# EasyEDA Pro project full_pcb_files.epro, board PCB2
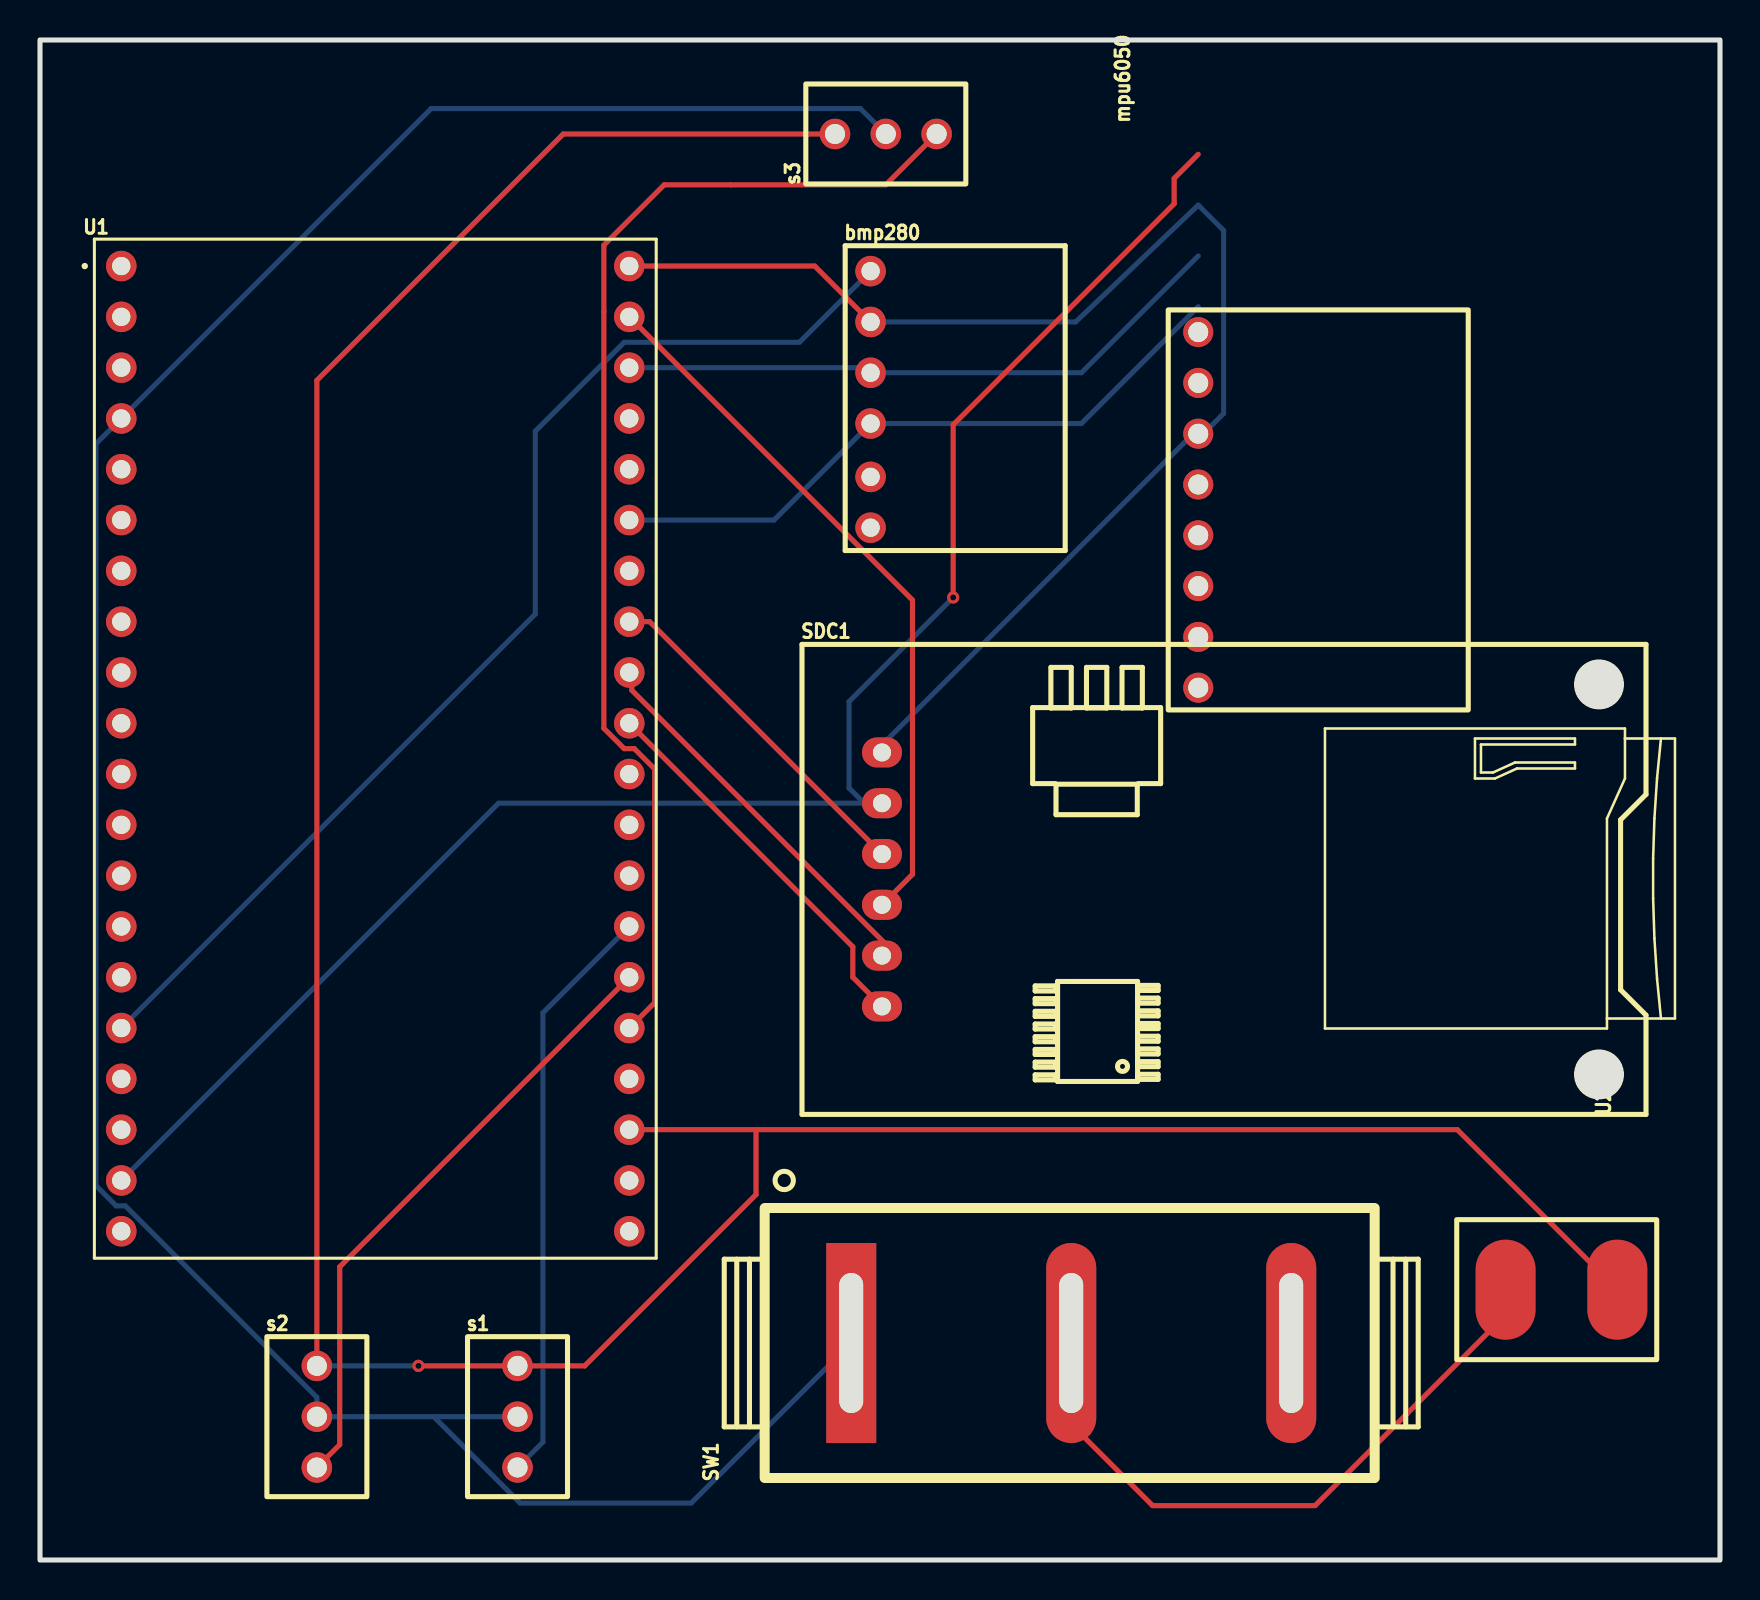
[diagram p1: board, top side]
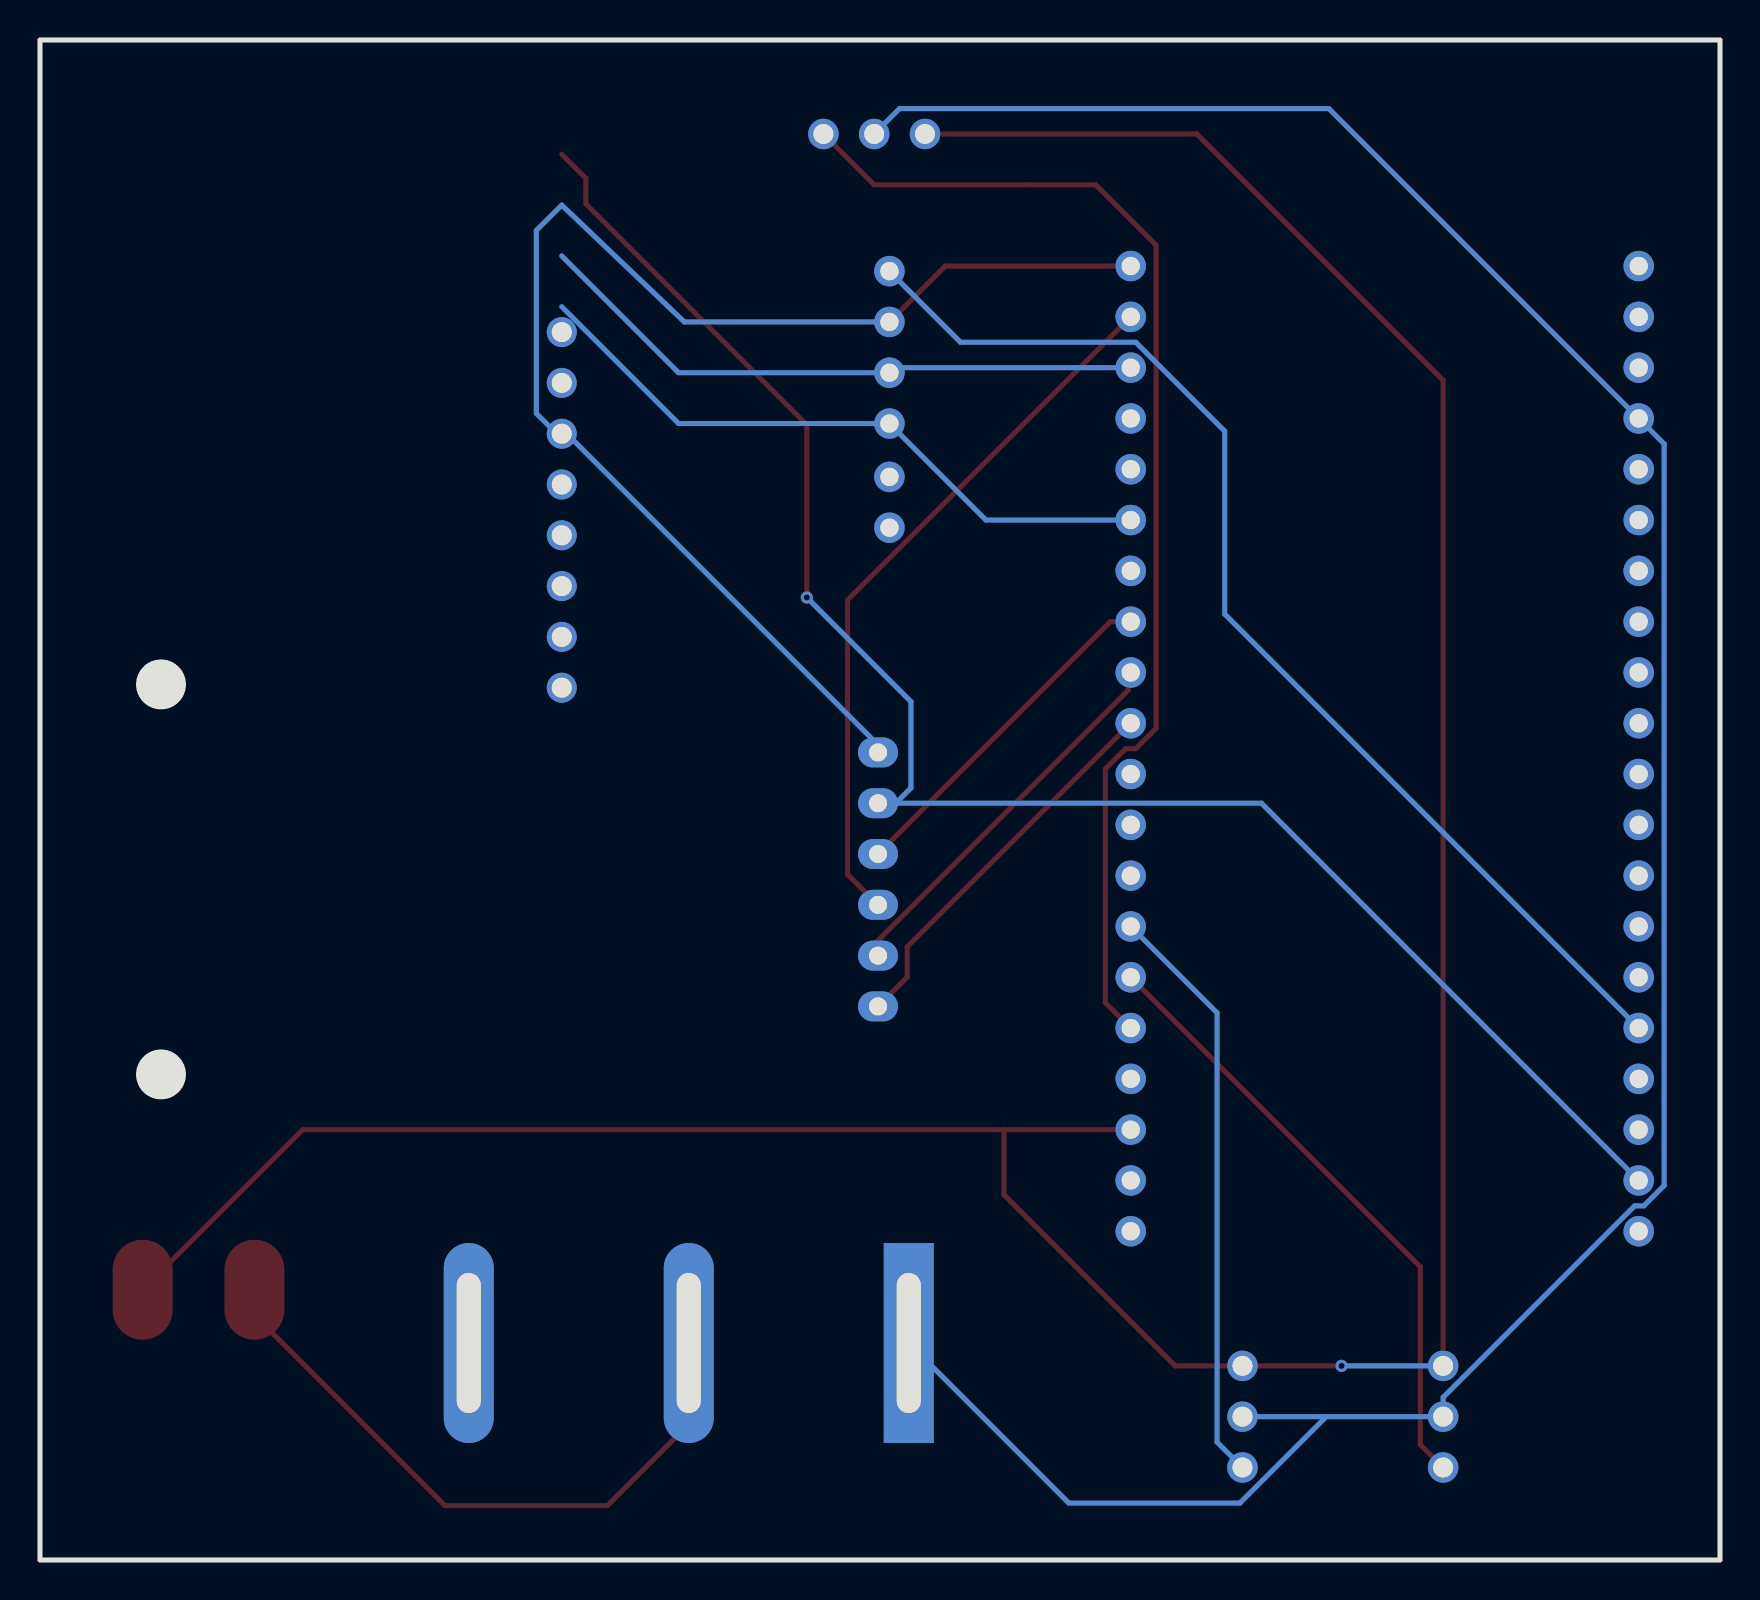
[diagram p2: board, bottom side, seen from below]

Outline 84 x 76 mm; copper layers: Top Layer, Bottom Layer. Coordinates in mm from the lower left corner of the outline.
Outline path: rectangle 0,76 84,0
Stack: Top Layer 0.035mm / Dielectric1 1.51mm FR4 er 4.5 / Bottom Layer 0.035mm

## Design rules (mm)
template: JLCPCB Capability(Two Layers Board)
spacing copperThickness1oz (default): track to track 0.102, other pairs 0.152 to 0.3
spacing copperThickness2oz: track to track 0.203, other pairs 0.152 to 0.3
track width copperThickness1oz (default): min 0.127, default 0.254, max 2.54
track width copperThickness2oz: min 0.203, default 0.254, max 2.54
differential pair differentialPair (default): width min 0.127, default 0.254, max 2.54; gap min 0.152, default 0.152
via viaSize (default): diameter min 0.5, default 0.61, max 10; hole min 0.3, default 0.305, max 6.3

## Placement (name value [footprint] x y rotation side)
bmp280  -  [HW-611 (BME/BMP280)]  51.18 64.44 0 top
mpu6050  -  [GY-521]  57.91 61.39 270 top
s1  -  [servo]  23.88 7.17 0 top
s2  -  [servo]  13.84 7.17 0 top
s3  -  [servo]  42.29 71.3 90 top
SDC1  MICROSD CARD ADAPTER  [MICRO-SD-CARD-ADAPTER]  38.1 22.28 0 top
SW1  RS606-10N011CG1B-3A  [SW-TH_RS606-101N011CRB]  51.56 10.85 90 top
U1  -  [Freenove ESP32 WROOM]  16.76 40.57 0 top
U2  -  [12vto5vfootprint]  76.07 13.52 270 top

## Footprints (pads in the part's own frame, mm; a bottom-side part is the same pattern mirrored in y, then rotated)
12vto5vfootprint
  oval 5x3 smd: 1(0,2.794) 2(0,-2.794)
Freenove ESP32 WROOM
  round 1.524 hole 0.914: 1(-12.7,24.13) 2(-12.7,21.59) 3(-12.7,19.05) 4(-12.7,16.51) 5(-12.7,13.97) 6(-12.7,11.43) 7(-12.7,8.89) 8(-12.7,6.35) 9(-12.7,3.81) 10(-12.7,1.27) 11(-12.7,-1.27) 12(-12.7,-3.81) 13(-12.7,-6.35) 14(-12.7,-8.89) 15(-12.7,-11.43) 16(-12.7,-13.97) 17(-12.7,-16.51) 18(-12.7,-19.05) 19(-12.7,-21.59) 20(-12.7,-24.13) 21(12.7,-24.13) 22(12.7,-21.59) 23(12.7,-19.05) 24(12.7,-16.51) 25(12.7,-13.97) 26(12.7,-11.43) 27(12.7,-8.89) 28(12.7,-6.35) 29(12.7,-3.81) 30(12.7,-1.27) 31(12.7,1.27) 32(12.7,3.81) 33(12.7,6.35) 34(12.7,8.89) 35(12.7,11.43) 36(12.7,13.97) 37(12.7,16.51) 38(12.7,19.05) 39(12.7,21.59) 40(12.7,24.13)
GY-521
  oval 1.5x1.5 hole 1: 1(0,0) 2(2.54,0) 3(5.08,0) 4(7.62,0) 5(10.16,0) 6(12.7,0) 7(15.24,0) 8(17.78,0)
HW-611 (BME/BMP280)
  round 1.524 hole 0.914: 1(-9.652,0) 2(-9.652,-2.54) 3(-9.652,-5.08) 4(-9.652,-7.62) 5(-9.652,-10.287) 6(-9.652,-12.827)
MICRO-SD-CARD-ADAPTER
  oval 2x1.5 hole 0.9: CS(4,5.4) GND(4,18.1) MISO(4,13.02) MOSI(4,10.48) SCK(4,7.94) VCC5V(4,15.56)
servo
  round 1.524 hole 1: 1(0,2.54) 2(0,0) 3(0,-2.54)
SW-TH_RS606-101N011CRB
  rect 10x2.5 hole 7x1.2: 1(0,11)
  oval 10x2.5 hole 7x1.2: 2(0,0) 3(0,-11)

## Nets
GND: bmp280.2 mpu6050.2 s1.1 s2.1 s3.1 SDC1.GND U1.40
3.3: bmp280.1 U1.16
5: mpu6050.1 SDC1.VCC5V U1.19
BAT: SW1.2
CS: SDC1.CS U1.31
MISO: SDC1.MISO U1.33
MOSI: SDC1.MOSI U1.39
PWROUT: s1.2 s2.2 s3.2 SW1.1 U1.4
SCK: SDC1.SCK U1.32
SCL: bmp280.3 mpu6050.3 U1.38
SDA: bmp280.4 mpu6050.4 U1.35
SERVO1: s1.3 U1.27
SERVO2: s2.3 U1.26
SERVO3: s3.3 U1.25

Pads without a net: bmp280 5 6; mpu6050 5 6 7 8; SW1 3; U1 1 2 3 5 6 7 8 9 10 11 12 13 14 15 17 18 20 21 22 23 24 28 29 30 34 36 37; U2 1 2

## Via types
v1: diameter 0.61, hole 0.305, Top Layer to Bottom Layer, 2 vias

## Routing (per net, layer and track width the routed paths; a pad name or vN(x,y) marks a point on that pad's centre or on a via; arc(x,y) is an arc through that point)
GND: length 176.2
  Top Layer w0.254: s2.1 13.84,58.98 26.16,71.3 s3.1 ; 19,9.71 27.24,9.71 35.8,18.27 35.8,21.52 ; U1.40 38.74,64.7 41.53,61.9
  Bottom Layer w0.254: v1(18.92,9.71) s2.1 ; 41.53,61.9 51.78,61.9 57.91,67.75 59.18,66.47 59.18,57.33 58.17,56.31 57.66,56.31 42.16,40.82 42.16,40.44 42.1,40.38
3.3: length 58.5
  Bottom Layer w0.254: U1.16 24.76,47.3 24.76,56.44 29.21,60.89 37.97,60.89 41.53,64.44
5: length 85.8
  Top Layer w0.254: v1(45.66,48.13) 45.66,56.76 56.71,67.81 56.71,69.08 57.91,70.28
  Bottom Layer w0.254: 41.21,37.84 SDC1.VCC5V ; 41.21,37.84 22.93,37.84 U1.19 ; 41.21,37.84 40.45,38.6 40.45,42.92 v1(45.66,48.13)
CS: length 19.4
  Top Layer w0.254: U1.31 40.64,30.66 40.64,29.14 SDC1.CS
MISO: length 17.4
  Top Layer w0.254: 42.1,35.3 30.48,46.92 U1.33
MOSI: length 35.9
  Top Layer w0.254: U1.39 43.62,48 43.62,34.28 SDC1.MOSI
PWROUT: length 136.5
  Bottom Layer w0.254: s1.2 19.69,7.17 ; 19.69,7.17 s2.2 13.84,8.13 4.27,17.71 3.81,17.71 2.79,18.72 2.79,55.81 U1.4 19.56,72.57 41.02,72.57 s3.2 ; 19.69,7.17 24,2.85 32.56,2.85 SW1.1
SCK: length 19.5
  Top Layer w0.254: SDC1.SCK 42.23,30.35 42.23,30.85 29.59,43.49 29.59,44.25 U1.32
SCL: length 31
  Bottom Layer w0.254: U1.38 41.28,59.62 41.53,59.36 52.07,59.36 57.91,65.2
SDA: length 32.9
  Bottom Layer w0.254: U1.35 36.7,52 41.53,56.82 52.07,56.82 57.91,62.67
SERVO1: length 29.4
  Bottom Layer w0.254: U1.27 25.15,27.36 25.15,5.9 s1.3
SERVO2: length 31
  Top Layer w0.254: s2.3 14.99,5.77 14.99,14.66 U1.26
SERVO3: length 60
  Top Layer w0.254: s3.3 42.29,68.76 31.21,68.76 28.19,65.74 28.19,41.58 29.21,40.57 29.72,40.57 30.73,39.55 30.73,27.87 U1.25
BAT: length 30.1
  Top Layer w0.254: 51.56,9.71 51.56,6.79 55.63,2.72 63.75,2.72 73.15,12.12
